# EAGLE schematic LeftProMicro (EAGLE 8.2.0)
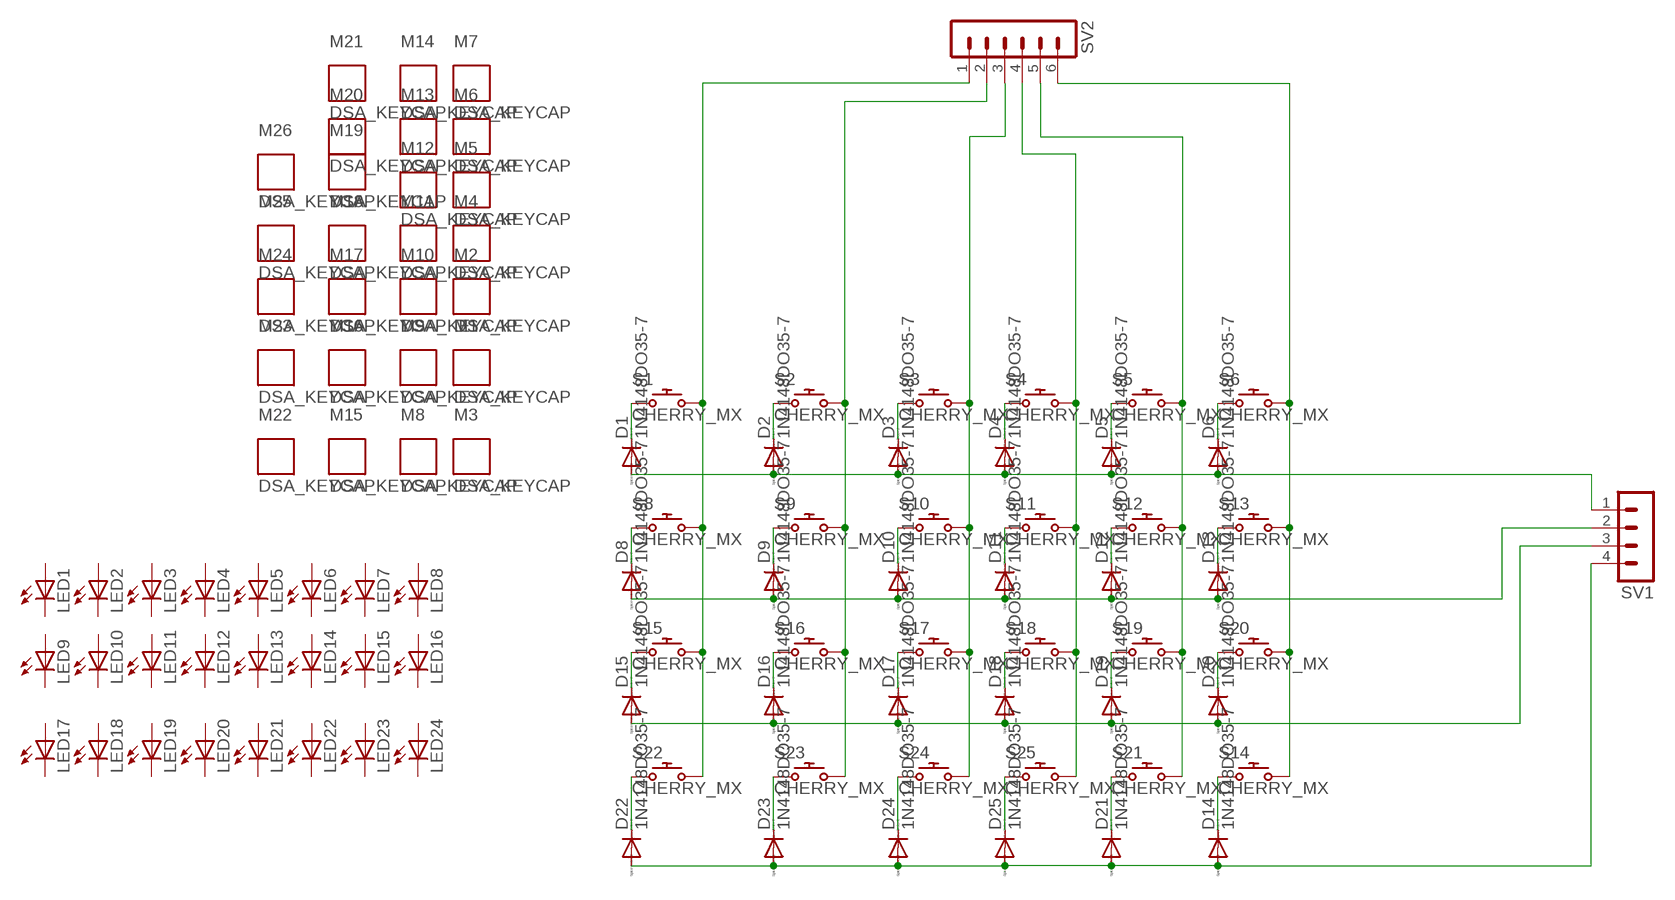
[diagram p0: schematic, sheet 1]

## Parts
D1  1N4148DO35-7  [DO35-7]
D2  1N4148DO35-7  [DO35-7]
D3  1N4148DO35-7  [DO35-7]
D4  1N4148DO35-7  [DO35-7]
D5  1N4148DO35-7  [DO35-7]
D6  1N4148DO35-7  [DO35-7]
D8  1N4148DO35-7  [DO35-7]
D9  1N4148DO35-7  [DO35-7]
D10  1N4148DO35-7  [DO35-7]
D11  1N4148DO35-7  [DO35-7]
D12  1N4148DO35-7  [DO35-7]
D13  1N4148DO35-7  [DO35-7]
D14  1N4148DO35-7  [DO35-7]
D15  1N4148DO35-7  [DO35-7]
D16  1N4148DO35-7  [DO35-7]
D17  1N4148DO35-7  [DO35-7]
D18  1N4148DO35-7  [DO35-7]
D19  1N4148DO35-7  [DO35-7]
D20  1N4148DO35-7  [DO35-7]
D21  1N4148DO35-7  [DO35-7]
D22  1N4148DO35-7  [DO35-7]
D23  1N4148DO35-7  [DO35-7]
D24  1N4148DO35-7  [DO35-7]
D25  1N4148DO35-7  [DO35-7]
LED1  LED3MM  [LED3MM]
LED2  LED3MM  [LED3MM]
LED3  LED3MM  [LED3MM]
LED4  LED3MM  [LED3MM]
LED5  LED3MM  [LED3MM]
LED6  LED3MM  [LED3MM]
LED7  LED3MM  [LED3MM]
LED8  LED3MM  [LED3MM]
LED9  LED3MM  [LED3MM]
LED10  LED3MM  [LED3MM]
LED11  LED3MM  [LED3MM]
LED12  LED3MM  [LED3MM]
LED13  LED3MM  [LED3MM]
LED14  LED3MM  [LED3MM]
LED15  LED3MM  [LED3MM]
LED16  LED3MM  [LED3MM]
LED17  LED3MM  [LED3MM]
LED18  LED3MM  [LED3MM]
LED19  LED3MM  [LED3MM]
LED20  LED3MM  [LED3MM]
LED21  LED3MM  [LED3MM]
LED22  LED3MM  [LED3MM]
LED23  LED3MM  [LED3MM]
LED24  LED3MM  [LED3MM]
M1  DSA_KEYCAP  [DSA_KEYCAP]
M2  DSA_KEYCAP  [DSA_KEYCAP]
M3  DSA_KEYCAP  [DSA_KEYCAP]
M4  DSA_KEYCAP  [DSA_KEYCAP]
M5  DSA_KEYCAP  [DSA_KEYCAP]
M6  DSA_KEYCAP  [DSA_KEYCAP]
M7  DSA_KEYCAP  [DSA_KEYCAP]
M8  DSA_KEYCAP  [DSA_KEYCAP]
M9  DSA_KEYCAP  [DSA_KEYCAP]
M10  DSA_KEYCAP  [DSA_KEYCAP]
M11  DSA_KEYCAP  [DSA_KEYCAP]
M12  DSA_KEYCAP  [DSA_KEYCAP]
M13  DSA_KEYCAP  [DSA_KEYCAP]
M14  DSA_KEYCAP  [DSA_KEYCAP]
M15  DSA_KEYCAP  [DSA_KEYCAP]
M16  DSA_KEYCAP  [DSA_KEYCAP]
M17  DSA_KEYCAP  [DSA_KEYCAP]
M18  DSA_KEYCAP  [DSA_KEYCAP]
M19  DSA_KEYCAP  [DSA_KEYCAP]
M20  DSA_KEYCAP  [DSA_KEYCAP]
M21  DSA_KEYCAP  [DSA_KEYCAP]
M22  DSA_KEYCAP  [DSA_KEYCAP]
M23  DSA_KEYCAP  [DSA_KEYCAP]
M24  DSA_KEYCAP  [DSA_KEYCAP]
M25  DSA_KEYCAP  [DSA_KEYCAP]
M26  DSA_KEYCAP  [DSA_KEYCAP]
S1  CHERRY_MX  [CHERRY_MX]
S2  CHERRY_MX  [CHERRY_MX]
S3  CHERRY_MX  [CHERRY_MX]
S4  CHERRY_MX  [CHERRY_MX]
S5  CHERRY_MX  [CHERRY_MX]
S6  CHERRY_MX  [CHERRY_MX]
S8  CHERRY_MX  [CHERRY_MX]
S9  CHERRY_MX  [CHERRY_MX]
S10  CHERRY_MX  [CHERRY_MX]
S11  CHERRY_MX  [CHERRY_MX]
S12  CHERRY_MX  [CHERRY_MX]
S13  CHERRY_MX  [CHERRY_MX]
S14  CHERRY_MX  [CHERRY_MX]
S15  CHERRY_MX  [CHERRY_MX]
S16  CHERRY_MX  [CHERRY_MX]
S17  CHERRY_MX  [CHERRY_MX]
S18  CHERRY_MX  [CHERRY_MX]
S19  CHERRY_MX  [CHERRY_MX]
S20  CHERRY_MX  [CHERRY_MX]
S21  CHERRY_MX  [CHERRY_MX]
S22  CHERRY_MX  [CHERRY_MX]
S23  CHERRY_MX  [CHERRY_MX]
S24  CHERRY_MX  [CHERRY_MX]
S25  CHERRY_MX  [CHERRY_MX]
SV1  MA04-1  [MA04-1]
SV2  MA06-1  [MA06-1]

## Nets
N$1: D14.A D21.A D22.A D23.A D24.A D25.A SV1.4
N$2: D1.A D2.A D3.A D4.A D5.A D6.A SV1.1
N$3: D8.A D9.A D10.A D11.A D12.A D13.A SV1.2
N$4: D12.C S12.S1
N$5: S1.S2 S8.S2 S15.S2 S22.S2 SV2.1
N$6: S2.S2 S9.S2 S16.S2 S23.S2 SV2.2
N$7: S3.S2 S10.S2 S17.S2 S24.S2 SV2.3
N$8: S4.S2 S11.S2 S18.S2 S25.S2 SV2.4
N$9: S5.S2 S12.S2 S19.S2 S21.S2 SV2.5
N$10: S6.S2 S13.S2 S14.S2 S20.S2 SV2.6
N$12: D1.C S1.S1
N$13: D8.C S8.S1
N$14: D15.C S15.S1
N$15: D22.C S22.S1
N$16: D23.C S23.S1
N$17: D16.C S16.S1
N$18: D9.C S9.S1
N$19: D2.C S2.S1
N$20: D3.C S3.S1
N$21: D10.C S10.S1
N$22: D17.C S17.S1
N$23: D24.C S24.S1
N$24: D25.C S25.S1
N$25: D18.C S18.S1
N$26: D11.C S11.S1
N$27: D4.C S4.S1
N$28: D5.C S5.S1
N$29: D6.C S6.S1
N$31: D14.C S14.S1
N$32: D13.C S13.S1
N$33: D19.C S19.S1
N$34: D20.C S20.S1
N$35: D21.C S21.S1
N$36: D15.A D16.A D17.A D18.A D19.A D20.A SV1.3
Unconnected: LED1.A LED1.K(C) LED2.A LED2.K(C) LED3.A LED3.K(C) LED4.A LED4.K(C) LED5.A LED5.K(C) LED6.A LED6.K(C) LED7.A LED7.K(C) LED8.A LED8.K(C) LED9.A LED9.K(C) LED10.A LED10.K(C) LED11.A LED11.K(C) LED12.A LED12.K(C) LED13.A LED13.K(C) LED14.A LED14.K(C) LED15.A LED15.K(C) LED16.A LED16.K(C) LED17.A LED17.K(C) LED18.A LED18.K(C) LED19.A LED19.K(C) LED20.A LED20.K(C) LED21.A LED21.K(C) LED22.A LED22.K(C) LED23.A LED23.K(C) LED24.A LED24.K(C)

## Library data of the parts
D1-D6 D8-D25 = diode:1N4148: DIODE high speed (Philips)
LED1-LED24 = led:LED: LED OSRAM: - CHIPLED LG R971, LG N971, LY N971, LG Q971, LY Q971, LO R971, LY R971 LH N974, LH R974 LS Q976, LO Q976, LY Q976 LO Q996 - Hyper CHIPLED LW Q18S LB Q993, LB Q99A, LB R99A - SideLED LS A670, LO A670, LY A670, LG A670, LP A670 LB A673, LV A673, LT A673, LW A673 LH A674 LY A675 LS A676, LA A676, LO A676, LY A676, LW A676 LS A679, LY A679, LG A679 - Hyper Micro SIDELED® LS Y876, LA Y876, LO Y876, LY Y876 LT Y87S - SmartLED LW L88C, LW L88S LB L89C, LB L89S, LG L890 LS L89K, LO L89K, LY L89K LS L896, LA L896, LO L896, LY L896 - TOPLED LS T670, LO T670, LY T670, LG T670, LP T670 LSG T670, LSP T670, LSY T670, LOP T670, LYG T670 LG T671, LOG T671, LSG T671 LB T673, LV T673, LT T673, LW T673 LH T674 LS T676, LA T676, LO T676, LY T676, LB T676, LH T676, LSB T676, LW T676 LB T67C, LV T67C, LT T67C, LS T67K, LO T67K, LY T67K, LW E67C LS E67B, LA E67B, LO E67B, LY E67B, LB E67C, LV E67C, LT E67C LW T67C LS T679, LY T679, LG T679 LS T770, LO T770, LY T770, LG T770, LP T770 LB T773, LV T773, LT T773, LW T773 LH T774 LS E675, LA E675, LY E675, LS T675 LS T776, LA T776, LO T776, LY T776, LB T776 LHGB T686 LT T68C, LB T68C - Hyper Mini TOPLED® LB M676 - Mini TOPLED Santana® LG M470 LS M47K, LO M47K, LY M47K Source: http://www.osram.convergy.de LUXEON: - LUMILED® LXK2-PW12-R00, LXK2-PW12-S00, LXK2-PW14-U00, LXK2-PW14-V00 LXK2-PM12-R00, LXK2-PM12-S00, LXK2-PM14-U00 LXK2-PE12-Q00, LXK2-PE12-R00, LXK2-PE12-S00, LXK2-PE14-T00, LXK2-PE14-U00 LXK2-PB12-K00, LXK2-PB12-L00, LXK2-PB12-M00, LXK2-PB14-N00, LXK2-PB14-P00, LXK2-PB14-Q00 LXK2-PR12-L00, LXK2-PR12-M00, LXK2-PR14-Q00, LXK2-PR14-R00 LXK2-PD12-Q00, LXK2-PD12-R00, LXK2-PD12-S00 LXK2-PH12-R00, LXK2-PH12-S00 LXK2-PL12-P00, LXK2-PL12-Q00, LXK2-PL12-R00 Source: www.luxeon.com KINGBRIGHT: KA-3528ASYC Source: www.kingbright.com
M1-M26 = cherry:DSA_KEYCAP: DSA keycap
S1-S6 S8-S25 = cherry:CHERRY_MX: Cherry keymodule MX; FARNELL: 2292961; MOUSER: 540-MX1A-11NW
SV1 = con-lstb:MA04-1: PIN HEADER; OC_FARNELL: unknown; OC_NEWARK: unknown
SV2 = con-lstb:MA06-1: PIN HEADER; OC_FARNELL: unknown; OC_NEWARK: unknown